# Altium project pipe_nosim.PrjPCB
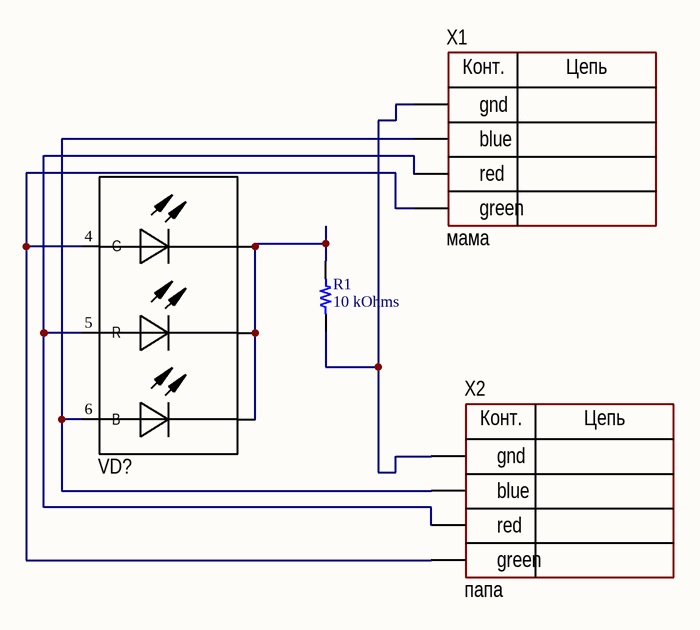
[diagram p0: pipe_nosim_schematic.SchDoc]
1 sheet, 4 parts. Net scope: global (net labels, ports and power ports of the same name join across sheets).
Board file: pipe_nosim_pcb.PcbDoc

## Sheet pipe_nosim_schematic.SchDoc
size A4; Address1: gnd

### Parts
R1  10 kOhms  [RES 0603_1608]
VD?  VD?  [RGB]  (value not drawn)
X1  CommentText: мама  [CON: PBS-4 R]
X2  CommentText: папа  [4PLS RIGHT ANGLE 2]

### Nets
NetR1_1: R1.1 VD?.1(G) VD?.2(G) VD?.3(G)
NetR1_2: R1.2 X1.1(gnd) X2.1(gnd)
NetVD?_4: VD?.4(G) X1.4(green) X2.4(green)
NetVD?_5: VD?.5(R) X1.3(red) X2.3(red)
NetVD?_6: VD?.6(B) X1.2(blue) X2.2(blue)

### Notes on the sheet
- (in symbol PBS-4) Конт.; Цепь
- (in symbol PLS-4) Конт.; Цепь

### Library data of the parts
R1 = RNCS0603BKE10K0: RES 10K OHM 0.1% 1/16W 0603; Manufacturer: Stackpole Electronics Inc; Power (Watts): 0.063W, 1/16W; Temperature Coefficient: ±25ppm/°C; Part Number: RNCS0603BKE10K0; Value: 10 kOhms; ComponentLink1Description: Datasheet; ComponentLink1URL: https://www.seielect.com/catalog/sei-rncs_rnch.pdf; ComponentLink2Description: DigiKey Link; ComponentLink2URL: http://digikey.com/product-detail/en/stackpole-electronics-inc/RNCS0603BKE10K0/RNCS0603BKE10K0CT-ND/1800113; Composition: Thin Film; Device Package: 0603 (1608 Metric); Features: Anti-Corrosive, Automotive AEC-Q200, Moisture Resistant; Height - Seated (Max): 0.022" (0.55mm); LastUpdated: 21.01.2020 0:25:01; Lifecycle Status: Active; Minimum Order: 1; Number of Terminations: 2; Operating Temperature: -55°C ~ 155°C; Package / Case: 0603 (1608 Metric); Packaging: TapeAndReel; PartId: 4838; Part Status: Active; Price: 0.08; Ratings: AEC-Q200; Resistance: 10 kOhms; Series: RNCS; Size / Dimension: 0.061" L x 0.031" W (1.55mm x 0.80mm); Supplier 1: DigiKey; Supplier Part Number 1: RNCS0603BKE10K0CT-ND; Supplier Device Package: 0603; Tolerance: ±0.1%
VD? = RGB
X1 = PBS-4: Manufacturer: Connfly; ValueManufacturerPartNumber: Connector, 4pin, 2.54mm, 500VAC, 3A; TypeConnector: Connector; VoltageMax: 500VAC; Pitch: 2.54mm; CurrentMax: 3A; Multichannel: 4pin; HelpURL: https://www.chipdip.ru/product/pbs-4; PartNumber: PBS-4
X2 = PLS-4: Manufacturer: Connfly; ValueManufacturerPartNumber: Connector, 4pin, 2.54mm, 500VAC, 3A; TypeConnector: Connector; VoltageMax: 500VAC; Pitch: 2.54mm; CurrentMax: 3A; Multichannel: 4pin; HelpURL: https://www.chipdip.ru/product/pls-4; PartNumber: PLS-4